# Altium schematic sheet Power_Supply.SchDoc: AC POWER METER
size 420 x 297 mm; DrawnBy: Truong Giang; DocumentNumber: Learning; SheetNumber: 3; SheetTotal: 6
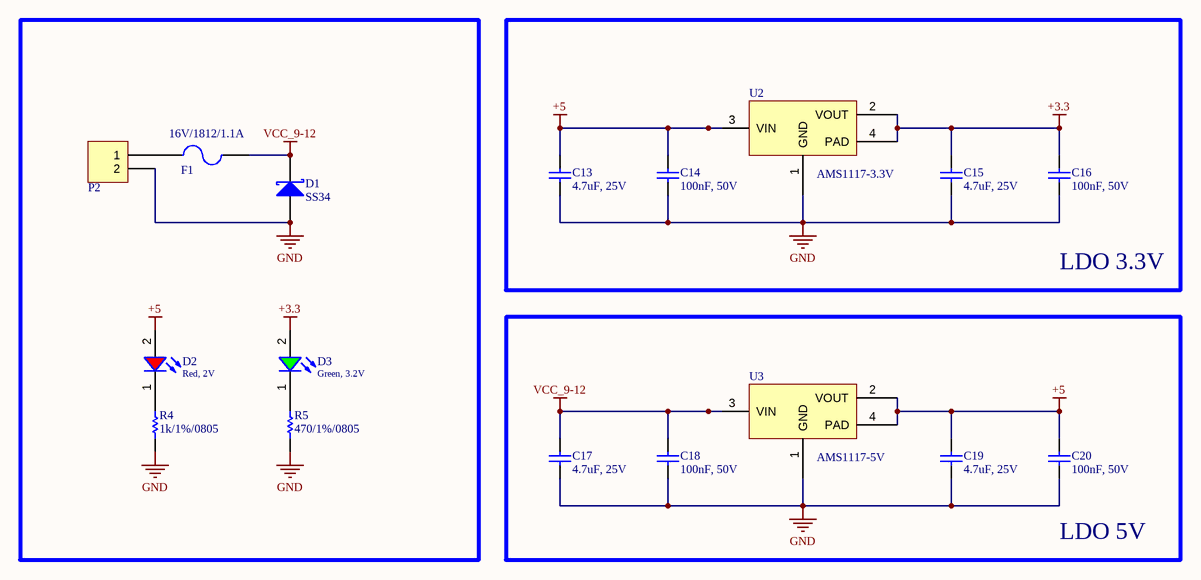
[diagram p0: Power_Supply.SchDoc]

## Parts
C13  4.7uF, 25V  [WCAP-CSGP_0805_H=1.25mm]
C14  100nF, 50V  [WCAP-CSGP_0805_H=0.8mm_Wave]
C15  4.7uF, 25V  [WCAP-CSGP_0805_H=1.25mm]
C16  100nF, 50V  [WCAP-CSGP_0805_H=0.8mm_Wave]
C17  4.7uF, 25V  [WCAP-CSGP_0805_H=1.25mm]
C18  100nF, 50V  [WCAP-CSGP_0805_H=0.8mm_Wave]
C19  4.7uF, 25V  [WCAP-CSGP_0805_H=1.25mm]
C20  100nF, 50V  [WCAP-CSGP_0805_H=0.8mm_Wave]
D1  D Schottky  [SS34]  (value not drawn)
D2  Red, 2V  [WL-SMCW_0805]
D3  Green, 3.2V  [WL-SMCW_0805]
F1  Fuse  [FUSE SMD]  (value not drawn)
P2  Domino 2  [DOMINO 2- 5mm]  (value not drawn)
R4  value 1k/1%/0805  [RES-SM-0805]  (hidden comment: RESISTOR SMD)
R5  value 470/1%/0805  [RES-SM-0805]  (hidden comment: RESISTOR SMD)
U2  AMS1117-3.3V  [SOT230P700X180-4N]
U3  AMS1117-5V  [SOT230P700X180-4N]

## Blocks framed on the sheet
16V/1812/1.1A: D1-D3 F1 P2 R4 R5
LDO 3.3V: C13-C16 U2
LDO 5V: C17-C20 U3

## Nets
+3.3: C15.2 C16.2 D3.2(A) U2.2(VOUT) U2.4(PAD)
+5: C13.2 C14.2 C19.2 C20.2 D2.2(A) U2.3(VIN) U3.2(VOUT) U3.4(PAD)
GND: C13.1 C14.1 C15.1 C16.1 C17.1 C18.1 C19.1 C20.1 D1.A P2.2 R4.1 R5.1 U2.1(GND) U3.1(GND)
VCC_9-12: C17.2 C18.2 D1.K F1.2 U3.3(VIN)
NetD2_1: D2.1(K) R4.2
NetD3_1: D3.1(K) R5.2
NetF1_1: F1.1 P2.1

## Notes on the sheet
- PROJECT
- TITLE
- DRAWN BY
- SIZE
- FILE NAME
- SHEET
- OF
- A3

## Library data of the parts
C13 C15 C17 C19 = 885012107018: WCAP-CSGP Multilayer Ceramic Chip Capacitor, General Purpose, size 0805, X5R, 4.7uF, 25V; Manufacturer: Wurth Elektronik; Rated Voltage: 25VDC; Isolation Resistance: >=0.02GOhm; Capacitance Tolerance: +/-20%; Technical Reference: X5R0805475M025DFCT10000; ComponentLink1Description: Manufacturer; ComponentLink1URL: http://www.we-online.de; ComponentLink2Description: Datasheet; ComponentLink2URL: https://www.we-online.com/catalog/datasheet/885012107018.pdf; Operating Temperature: -55 to +85degC; Packaging: Tape and Reel; Manufacturer Part Number: 885012107018; Published Date: May 2020; Ceramic Type: X5R; Dissipation Factor: =<10%; Height: 1.25mm; Mounting Technology: SMT; Size: 0805; Capacitance: 4.7uF
C14 C16 C18 C20 = 885012207098: WCAP-CSGP Multilayer Ceramic Chip Capacitor, General Purpose, size 0805, X7R, 100nF, 50V; Manufacturer: Wurth Elektronik; Rated Voltage: 50VDC; Isolation Resistance: >=5GOhm; Capacitance Tolerance: +/-10%; Technical Reference: X7R0805104K050DFCT10000; ComponentLink1Description: Manufacturer; ComponentLink1URL: http://www.we-online.de; ComponentLink2Description: Datasheet; ComponentLink2URL: https://www.we-online.com/catalog/datasheet/885012207098.pdf; Operating Temperature: -55 to +125degC; Packaging: Tape and Reel; Manufacturer Part Number: 885012207098; Published Date: May 2020; Ceramic Type: X7R; Dissipation Factor: =<2.5%; Height: 0.8mm; Mounting Technology: SMT; Size: 0805; Capacitance: 100nF
D1 = D Schottky: Schottky Diode; Published: 8-Jun-2000; LatestRevisionDate: 17-Jul-2002; LatestRevisionNote: Re-released for DXP Platform.; PackageReference: SMB; Publisher: Altium Limited; PackageDescription: DO-214-AA/SMB; 2 C-Bend Leads; Body 5.3 x 3.6 mm, inc. leads (LxW); Code_JEDEC: DO-214-AA; Supplier 1: Arrow Electronics; Supplier 2: RSComponents; Supplier Part Number 1: SS34; Supplier Part Number 2: 8080433
D2 = 150080RS75000: WL-SMCW SMT Mono-color Chip LED Waterclear, size 0805, Red, 2V, 140deg; Chip Technology: AlInGaP; Dominant Wavelength typ.: 625nm; Luminous Intensity typ.: 150mcd; Peak Wavelength typ.: 630nm; Viewing Angle: 140deg; ComponentLink1Description: Manufacturer; ComponentLink1URL: http://www.we-online.de; ComponentLink2URL: https://www.we-online.com/catalog/datasheet/150080RS75000.pdf; ComponentLink2Description: Datasheet; Forward Voltage typ.: 2V; Emitting Color: Red; Mounting Technology: SMT; Operating Temperature: -40 to +85degC; Published Date: December 2019; Part Number: 150080RS75000; Packaging: Tape and Reel; Size: 0805; Publisher: Wurth Elektronik
D3 = 150080GS75000: WL-SMCW SMT Mono-color Chip LED Waterclear, size 0805, Green, 3.2V, 140deg; Chip Technology: InGaN; Dominant Wavelength typ.: 525nm; Luminous Intensity typ.: 450mcd; Peak Wavelength typ.: 515nm; Viewing Angle: 140deg; ComponentLink1Description: Manufacturer; ComponentLink1URL: http://www.we-online.de; ComponentLink2URL: https://www.we-online.com/catalog/datasheet/150080GS75000.pdf; ComponentLink2Description: Datasheet; Forward Voltage typ.: 3.2V; Emitting Color: Green; Mounting Technology: SMT; Operating Temperature: -40 to +85degC; Published Date: December 2019; Part Number: 150080GS75000; Packaging: Tape and Reel; Size: 0805; Publisher: Wurth Elektronik
P2 = Domino 2: Domino, 2-Pin; LatestRevisionDate: 17-Jul-2002; LatestRevisionNote: Re-released for DXP Platform.; Publisher: Altium Limited
R4 R5 = RESISTOR SMD: Resistor